# Altium schematic sheet Nuio_Left_Keyboard_Rev_H_Power.SchDoc: Nuio - Left Keyboard Power
size B; Organization: OLogic, Inc.; SheetNumber: 3; SheetTotal: 5; PageSetup: Record=PageOptions|CenterHorizontal=True|CenterVertical=True|PrintScale=0.95|XCorrection=1.00|YCorrection=1.00|PrintKind=1|BorderSize=5000000|LeftOffset=0|BottomOffset=0|Orientation=2|PaperLength=1000|PaperWidth=1000|Scale=100|PaperSource=7|PrintQuality=-4|MediaType=1|DitherType=10|PaperKind=Letter|PrintScaleMode=1
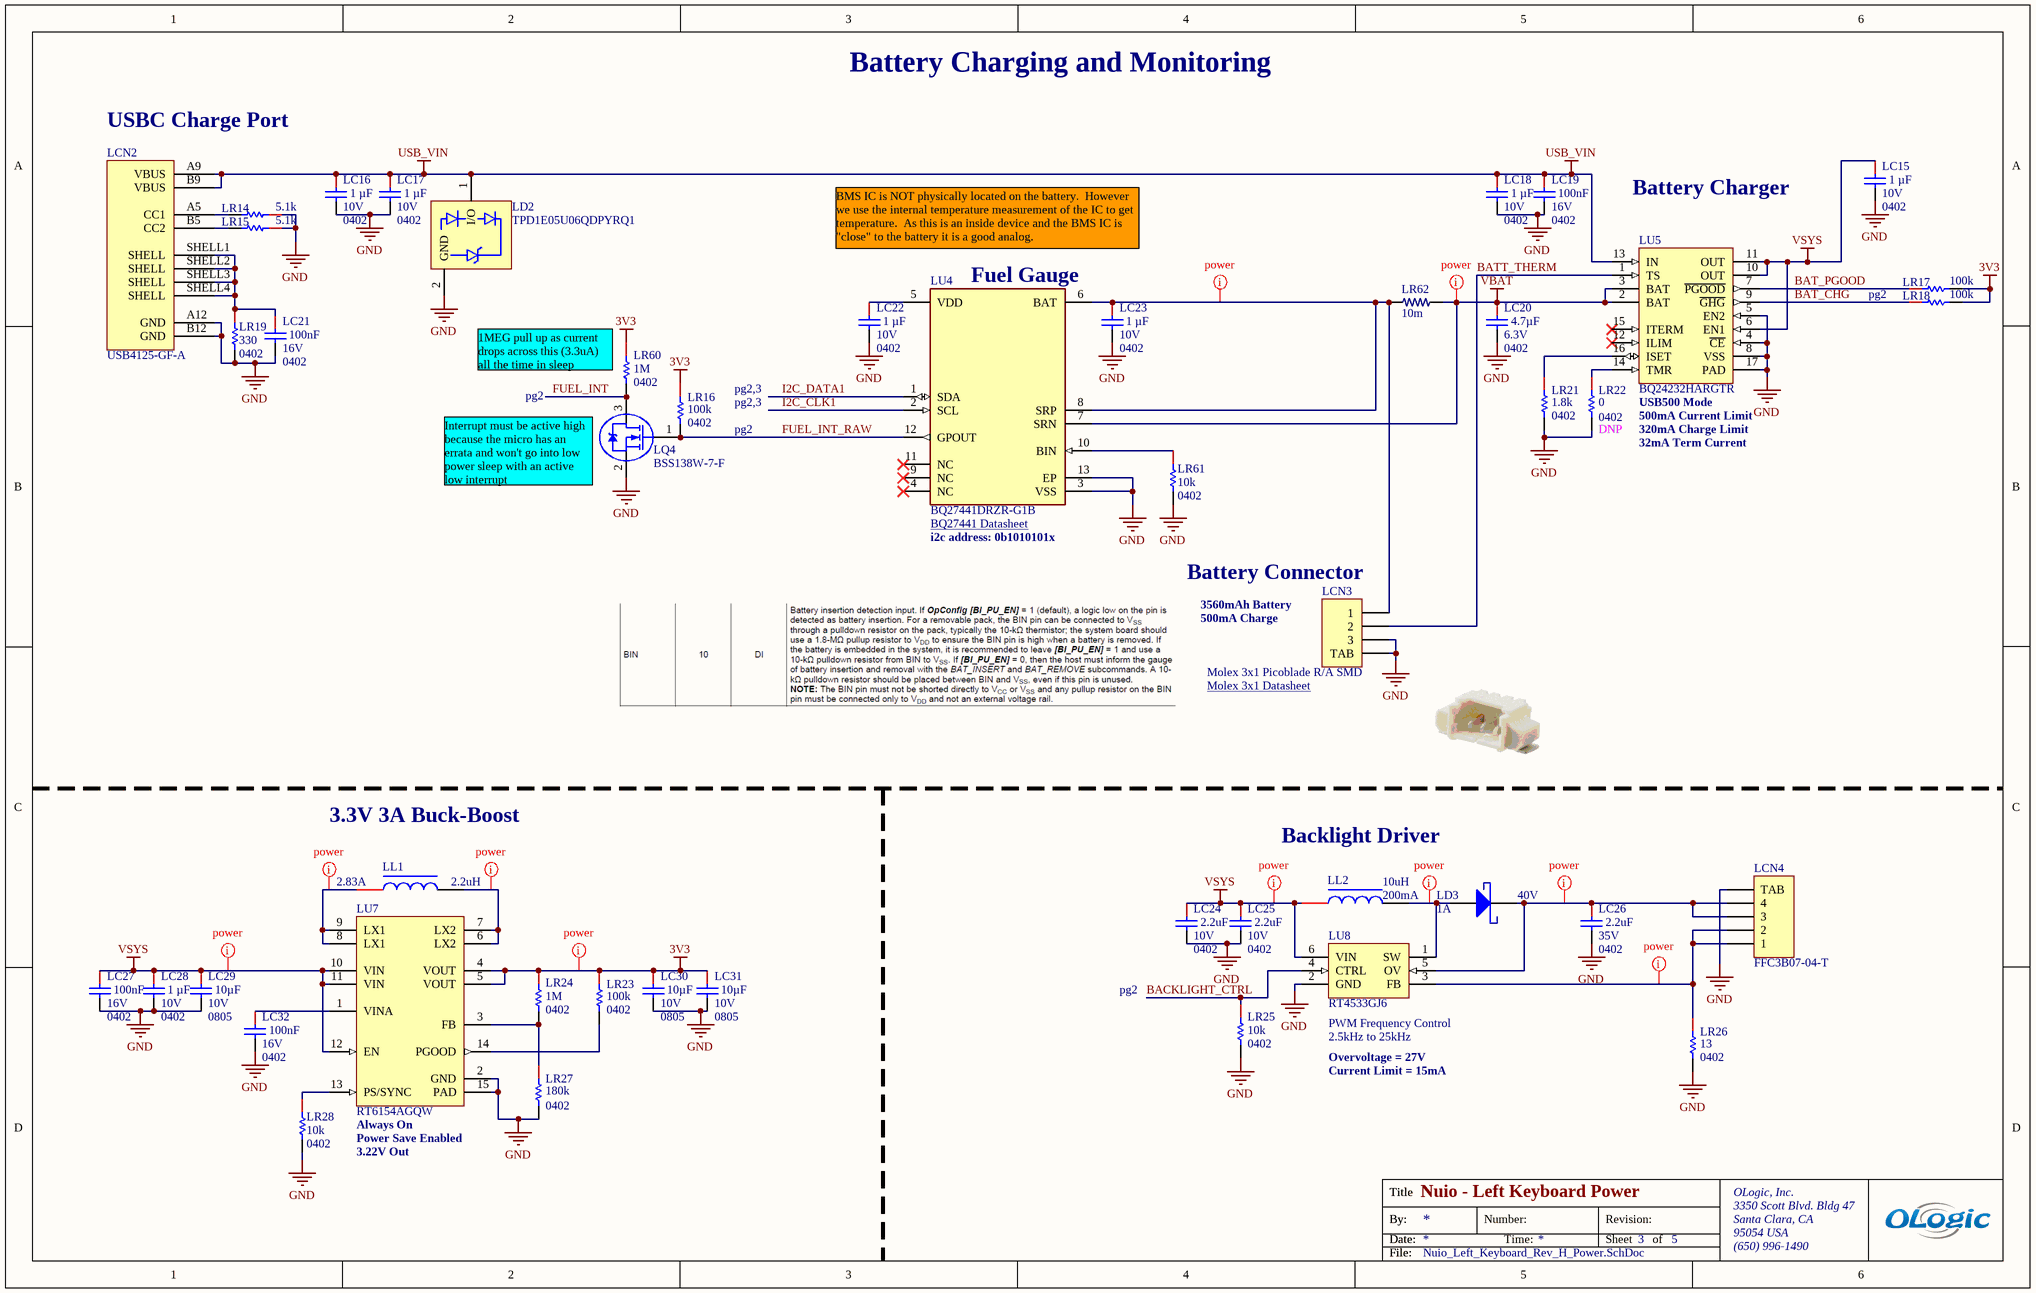
[diagram p0: Nuio_Left_Keyboard_Rev_H_Power.SchDoc]

## Parts
LC15  Package (Imperial): 0402  Voltage (Rated): 10V  Capacitance: 1 µF  [CAPC0402(1005)_L]  (hidden comment: CAP CER 1UF 10V X5R 0402)
LC16  Package (Imperial): 0402  Voltage (Rated): 10V  Capacitance: 1 µF  [CAPC0402(1005)_L]  (hidden comment: CAP CER 1UF 10V X5R 0402)
LC17  Package (Imperial): 0402  Voltage (Rated): 10V  Capacitance: 1 µF  [CAPC0402(1005)_L]  (hidden comment: CAP CER 1UF 10V X5R 0402)
LC18  Package (Imperial): 0402  Voltage (Rated): 10V  Capacitance: 1 µF  [CAPC0402(1005)_L]  (hidden comment: CAP CER 1UF 10V X5R 0402)
LC19  Package (Imperial): 0402  Voltage (Rated): 16V  Capacitance: 100nF  [CAPC0402(1005)_L]  (hidden comment: CAP CER 0.1UF 16V X5R 0402)
LC20  Package (Imperial): 0402  Voltage (Rated): 6.3V  Capacitance: 4.7µF  [CAPC0402(1005)_L]  (hidden comment: 4.7uF)
LC21  Package (Imperial): 0402  Voltage (Rated): 16V  Capacitance: 100nF  [CAPC0402(1005)_L]  (hidden comment: CAP CER 0.1UF 16V X5R 0402)
LC22  Package (Imperial): 0402  Voltage (Rated): 10V  Capacitance: 1 µF  [CAPC0402(1005)_L]  (hidden comment: CAP CER 1UF 10V X5R 0402)
LC23  Package (Imperial): 0402  Voltage (Rated): 10V  Capacitance: 1 µF  [CAPC0402(1005)_L]  (hidden comment: CAP CER 1UF 10V X5R 0402)
LC24  Package (Imperial): 0402  Voltage (Rated): 10V  Capacitance: 2.2uF  [CAPC0402(1005)_L]  (hidden comment: CAP CER 2.2UF 10V X5R 0402)
LC25  Package (Imperial): 0402  Voltage (Rated): 10V  Capacitance: 2.2uF  [CAPC0402(1005)_L]  (hidden comment: CAP CER 2.2UF 10V X5R 0402)
LC26  2.2uF  Voltage (Rated): 35V  Package (Imperial): 0402  [CAPC0402(1005)_L]
LC27  Package (Imperial): 0402  Voltage (Rated): 16V  Capacitance: 100nF  [CAPC0402(1005)_L]  (hidden comment: CAP CER 0.1UF 16V X5R 0402)
LC28  Package (Imperial): 0402  Voltage (Rated): 10V  Capacitance: 1 µF  [CAPC0402(1005)_L]  (hidden comment: CAP CER 1UF 10V X5R 0402)
LC29  Voltage (Rated): 10V  Package (Imperial): 0805  Capacitance: 10µF  [CAPC0805(2012)_L]  (hidden comment: CAP CER 10UF 10V X7R 0805)
LC30  Voltage (Rated): 10V  Package (Imperial): 0805  Capacitance: 10µF  [CAPC0805(2012)_L]  (hidden comment: CAP CER 10UF 10V X7R 0805)
LC31  Voltage (Rated): 10V  Package (Imperial): 0805  Capacitance: 10µF  [CAPC0805(2012)_L]  (hidden comment: CAP CER 10UF 10V X7R 0805)
LC32  Package (Imperial): 0402  Voltage (Rated): 16V  Capacitance: 100nF  [CAPC0402(1005)_L]  (hidden comment: CAP CER 0.1UF 16V X5R 0402)
LCN2  USB4125-GF-A  [USB4125-GF-A]
LCN3  Molex 3x1 Picoblade R/A SMD  [Molex 3x1 Picoblade R_A SMD]
LCN4  FFC3B07-04-T  [FFC3B07-04-T]
LD2  TPD1E05U06QDPYRQ1  [FP-DPY0002A-MFG]
LD3  DC Reverse Voltage Max: 40V  Current Avg Rectified: 1A  [PMEG4010AESBYL-Footprint-1]  (hidden comment: PMEG4010AESBYL)
LL1  Inductance: 2.2uH  Current Rating (Amps): 2.83A  [FIXED IND 2.2UH 2.83A 74MOHM SMD]  (hidden comment: FIXED IND 2.2UH 2.83A 74MOHM SMD)
LL2  value 10uH  Saturation Current: 200mA  [FIXED IND 10UH 300MA 680MOHM SMD]  (hidden comment: FIXED IND 10UH 300MA 680MOHM SMD)
LQ4  BSS138W-7-F  [DIOD-SOT323-3_V]
LR14  Resistance: 5.1k  [RESC0402(1005)_L]  (hidden comment: RES SMD 5.1K OHM 1% 1/10W 0402)
LR15  Resistance: 5.1k  [RESC0402(1005)_L]  (hidden comment: RES SMD 5.1K OHM 1% 1/10W 0402)
LR16  value 100k  Case Code (Imperial): 0402  [RESC0402(1005)_L]  (hidden comment: RES 100K OHM 1% 1/16W 0402)
LR17  value 100k  [RESC0402(1005)_L]  (hidden comment: RES 100K OHM 1% 1/16W 0402)
LR18  value 100k  [RESC0402(1005)_L]  (hidden comment: RES 100K OHM 1% 1/16W 0402)
LR19  Resistance: 330  Package (Imperial): 0402  [RESC0402(1005)_L]  (hidden comment: RES SMD 330 OHM 1% 1/16W 0402)
LR21  value 1.8k  Case Code (Imperial): 0402  [RESC0402(1005)_L]  (hidden comment: RES SMD 1.8K OHM 0.1% 1/16W 0402)
LR22  Package (Imperial): 0402  Resistance: 0  [RESC0402(1005)_L]  (hidden comment: RES 0 OHM JUMPER 1/16W 0402)  (no BOM)
LR23  value 100k  Case Code (Imperial): 0402  [RESC0402(1005)_L]  (hidden comment: RES 100K OHM 1% 1/16W 0402)
LR24  Resistance: 1M  Case/Package: 0402  [RESC0402(1005)_L]  (hidden comment: RES 1M OHM 1% 1/16W 0402)
LR25  Resistance: 10k  Package (Imperial): 0402  [RESC0402_YAGEO]  (hidden comment: RES SMD 10K OHM 1% 1/16W 0402)
LR26  13  Case/Package: 0402  [RESC0402(1005)_L]
LR27  Package (Imperial): 0402  [RESC0402(1005)_L]  (hidden comment: 180k)
LR28  Resistance: 10k  Package (Imperial): 0402  [RESC0402_YAGEO]  (hidden comment: RES SMD 10K OHM 1% 1/16W 0402)
LR60  Resistance: 1M  Case/Package: 0402  [RESC0402(1005)_L]  (hidden comment: RES 1M OHM 1% 1/16W 0402)
LR61  Resistance: 10k  Package (Imperial): 0402  [RESC0402_YAGEO]  (hidden comment: RES SMD 10K OHM 1% 1/16W 0402)
LR62  10m  [0805 PACKAGE]
LU4  BQ27441DRZR-G1B  [FP-DRZ0012A-MFG]
LU5  BQ24232HARGTR  [BQ24232HARGTR]
LU7  RT6154AGQW  [PSON50P300X80_HS-15N]
LU8  RT4533GJ6  [RT4533GJ6]

## Nets
3V3: LC30.1 LC31.1 LR16.1 LR17.2 LR18.2 LR23.1 LR24.1 LR60.1 LU7.4(VOUT) LU7.5(VOUT)
GND: LC15.2 LC16.2 LC17.2 LC18.2 LC19.2 LC20.2 LC21.2 LC22.2 LC23.2 LC24.2 LC25.2 LC26.2 LC27.2 LC28.2 LC29.2 LC30.2 LC31.2 LC32.2 LCN2.A12(GND) LCN2.B12(GND) LCN3.0(TAB) LCN3.3 LCN4.0(TAB) LD2.2(GND) LQ4.2(S) LR14.1 LR15.1 LR19.2 LR21.2 LR22.2 LR25.2 LR26.2 LR27.2 LR28.2 LR61.2 LU4.3(VSS) LU4.13(EP) LU5.4(~{CE}) LU5.5(EN2) LU5.8(VSS) LU5.17(PAD) LU7.2(GND) LU7.15(PAD) LU8.2(GND)
USB_VIN: LC16.1 LC17.1 LC18.1 LC19.1 LCN2.A9(VBUS) LCN2.B9(VBUS) LD2.1(I/O) LU5.13(IN)
VBAT: LC20.1 LR62.2 LU4.7(SRN) LU5.2(BAT) LU5.3(BAT)
VSYS: LC15.1 LC24.1 LC25.1 LC27.1 LC28.1 LC29.1 LL2.1 LU5.6(EN1) LU5.10(OUT) LU5.11(OUT) LU7.10(VIN) LU7.11(VIN) LU7.12(EN) LU8.6(VIN)
BACKLIGHT_CTRL: LR25.1 LU8.4(CTRL)
BAT_CHG: LR18.1 LU5.9(~{GHG})
BAT_PGOOD: LR17.1 LU5.7(~{PGOOD})
BATT_THERM: LCN3.2 LU5.1(TS)
FUEL_INT: LQ4.3(D) LR60.2
FUEL_INT_RAW: LQ4.1(G) LR16.2 LU4.12(GPOUT)
I2C_CLK1: LU4.2(SCL)
I2C_DATA1: LU4.1(SDA)
NetLC21_1: LC21.1 LCN2.SHELL1(SHELL) LCN2.SHELL2(SHELL) LCN2.SHELL3(SHELL) LCN2.SHELL4(SHELL) LR19.1
NetLC22_1: LC22.1 LU4.5(VDD)
NetLC23_1: LC23.1 LCN3.1 LR62.1 LU4.6(BAT) LU4.8(SRP)
NetLC26_1: LC26.1 LCN4.3 LCN4.4 LD3.1(K) LU8.5(OV)
NetLC32_1: LC32.1 LU7.1(VINA)
NetLCN2_A5: LCN2.A5(CC1) LR14.2
NetLCN2_B5: LCN2.B5(CC2) LR15.2
NetLCN4_1: LCN4.1 LCN4.2 LR26.1 LU8.3(FB)
NetLD3_2: LD3.2(A) LL2.2 LU8.1(SW)
NetLL1_1: LL1.1 LU7.8(LX1) LU7.9(LX1)
NetLL1_2: LL1.2 LU7.6(LX2) LU7.7(LX2)
NetLR21_1: LR21.1 LU5.16(ISET)
NetLR22_1: LR22.1 LU5.14(TMR)
NetLR23_2: LR23.2 LU7.14(PGOOD)
NetLR24_2: LR24.2 LR27.1 LU7.3(FB)
NetLR28_1: LR28.1 LU7.13(PS/SYNC)
NetLR61_1: LR61.1 LU4.10(BIN)

Not connected (* = marked no-connect by the designer): LU4 4(NC)* 9(NC)* 11(NC)*; LU5 12(ILIM)* 15(ITERM)*

## Layout directives
net class power: 3V3, NetLC23_1, NetLC26_1, NetLCN4_1, NetLD3_2, NetLL1_1, NetLL1_2, VBAT, VSYS

## Notes on the sheet
- Battery Charging and Monitoring
- (near LCN2) USBC Charge Port
- Battery Charger
- BMS IC is NOT physically located on the battery.  However we use the internal temperature measurement of the IC to get temperature.  As this is an inside device and the BMS IC is "close" to the battery it is a good analog.
- (near LU4) Fuel Gauge
- pg2
- (near LR60) 1MEG pull up as current drops across this (3.3uA) all the time in sleep
- pg2,3
- (near LR22) DNP
- 500mA Current Limit
- 320mA Charge Limit
- (near LU5) USB500 Mode
- Interrupt must be active high because the micro has an errata and won't go into low power sleep with an active low interrupt
- 32mA Term Current
- (near LU4) i2c address: 0b1010101x
- (near LU4) BQ27441 Datasheet <https://www.ti.com/lit/gpn/bq27441-g1>
- (near LCN3) Battery Connector
- 3560mAh Battery
- 500mA Charge
- (near LCN3) Molex 3x1 Datasheet <https://www.molex.com/pdm_docs/sd/532610371_sd.pdf>
- 3.3V 3A Buck-Boost
- Backlight Driver
- (near LU8) PWM Frequency Control
- (near LU8) 2.5kHz to 25kHz
- Overvoltage = 27V
- Current Limit = 15mA
- Power Save Enabled
- (near LU7) Always On
- 3.22V Out
- Title
- By:
- Date:
- Number:
- Time:
- Revision:
- Sheet
- of
- OLogic, Inc.
- 3350 Scott Blvd. Bldg 47
- Santa Clara, CA
- 95054 USA
- File:
- (650) 996-1490

## Library data of the parts
LC15-LC18 LC22 LC23 LC28 = CMP-001-1453-04: ±20% 10V Ceramic Capacitor X5R 0402 (1005 Metric); Manufacturer Part Number: CC0402MRX5R6BB105; Manufacturer: Yageo; Supplier: Digi-Key; Tolerance: ±20%; Supplier Part Number: 311-1732-1-ND; Temperature Coefficient: X5R; Height: 0.55mm
LC19 LC21 LC27 LC32 = CMP-001-0605-23: ±10% 16V Ceramic Capacitor X5R 0402 (1005 Metric); Manufacturer: Taiyo Yuden; Manufacturer Part Number: EMK105BJ104KV-F; Package (Metric): 1005; Temperature (Max): 85°C; Temperature (Min): -55°C; Height: 550µm; Supplier: Digi-Key; Supplier Part Number: 587-1226-1-ND; Tolerance: 10%; Dielectric Material: Ceramic; Temperature Coefficient: X5R; Width: 500µm; Length: 1mm; Mounting Type: SMD
LC20 = CMP-007-0148-15: CAP CER 4.7UF 6.3V 10% X5R 0402; Tolerance: 20%; Package (Metric): 1005; Dielectric Material: Ceramic; Mounting Type: SMD; Temperature Coefficient: X5R
LC24 LC25 = CMP-001-1451-04: ±20% 10V Ceramic Capacitor X5R 0402 (1005 Metric); Manufacturer: KEMET; Manufacturer Part Number: C0402C225M8PACTU; Width: 0.5mm; Height: 0.5mm; Tolerance: 20%; Voltage Rating (DC): 10V; Supplier: Digi-Key; Depth: 0.5mm; Dielectric: X5R; Supplier Part Number: 399-7375-1-ND; Contact Plating: Tin,Matte; Termination: SMD/SMT; Thickness: 0.022inch; Dielectric Material: Ceramic; Temperature Coefficient: X5R; Length: 1mm; Max Operating Temperature: 85°C; Min Operating Temperature: -55°C; Mount: Surface Mount; Lead Free: Lead Free; Series: C
LC26 = CMP-007-0115-14: CAP CER 2.2UF 35V 10% X5R 0402; Capacitance: 2.2µF; Dielectric Material: Ceramic; Package (Metric): 1005; Tolerance: 10%; Temperature Coefficient: X5R; Mounting Type: SMD
LC29-LC31 = CMP-001-0889-04: 10µF ±10% 10V Ceramic Capacitor X7R 0805 (2012 Metric); Manufacturer Part Number: GRM21BR71A106KA73K; Package (Metric): 2012; Voltage Rating: 10V; Length: 2mm; Mounting Type: SMD; Height: 1.4mm; Mount: Surface Mount; Case Code (Metric): 2012; Min Operating Temperature: -55°C; Ratings: AEC-Q200; Width: 1.25mm; Packaging: Tape and Reel; Tolerance: 10%; Temperature Coefficient: X7R; Case Code (Imperial): 0805; Max Operating Temperature: 125°C; Case/Package: 0805; Dielectric Material: Ceramic
LCN2 = CMP-001-2121-03: USB-C (USB TYPE-C) Receptacle Connector 24 (6+18 Dummy) Position Surface Mount, Right Angle; Through Hole; Manufacturer: GCT; Mating Cycles: 20000; Current Rating: 3A; Shielding: Shielded; Material Flammability: UL94 V-0; Voltage: 20V; Connector Type: USB-C; Number of Contacts: 24 (6 + 18 Dummy); Gender: Receptacle; Series: USB4125; Contact Finish: Gold; Shell/Shielding Material: Steel, Stainless
LCN3 = CMP-00344-01: 1.25mm (.049") Pitch PicoBlade Header, Surface Mount, Right Angle, Lead-free, 3 Circuits; Manufacturer Series: 53261; Manufacturer Part Number 1: 53261-0371; Plating: Tin; Number of Positions: 3; Contact Resistance: 20mR; Option: General Purpose; Current Rating: 1A; Voltage Rating: 125V; Mixed Contacts: No; Number of Rows Loaded: 1; Insulation Resistance: 100MR; Gender: Male; Glow Wire Compliant: Non-compliant; Series: PicoBlade; Supplier 1: Digikey; RoHS: Yes; Category: Headers and Wire Housings; Stock 1: 7759; Pricing 1: 1=0.66, 10=0.558, 100=0.4344 (USD); Mounting Technology: Surface Mount,Board; Contact Plating: Tin; Contact Material: Bronze,Tin; Color: Natural; Housing Color: Natural; Housing Material: Nylon; Min Operating Temperature: -40°C; Max Operating Temperature: 85°C; Number of Rows: 1; Packaging: Tape and Reel; Termination: Solder; Orientation: Right Angle; Number of Contacts: 3; Contact Type: Blade Pin; Contact Gender: Male; Mounting Style: STRAIGHT; Filter Feature: No; Voltage Rating (AC): 125V; Working Voltage: 125V; Number of Circuits: 3; Voltage Rating (DC): 125V; Length: 8.9mm; Pitch: 1.25mm; Depth: 5.2mm; Radiation Hardening: No; RoHS Compliant: Yes; Flammability Rating: 5813Flammability; MIL Conformance: No; DIN Conformance: No; IEC Conformance: No; Reach SVHC Compliant: Unknown; Lead Free: Lead Free; Supplier Part Number 1: WM7621CT-ND; Manufacturer 1: Molex
LCN4 = CMP-001-2018-02: CONN, FPC, 4POS, 1ROW, 1MM, R/A SMT; Pitch Spacing: 1mm; No. of Contacts: 4Contacts; Gender: Receptacle; Product...; Manufacturer: GCT; Locking Feature: Slide Lock; Connector/Contact Type: Contacts, Bottom; Mating Cycles: 20; Number of Positions: 4; Voltage Rating: 50V; Current Rating: 0.4A; Contact Finish: Tin; Mounting Type: SM R/A; Pitch: 1mm
LD2 = CMP-009-0040-02: TVS DIODE 5.5V 14V 2X1SON; Manufacturer: Texas Instruments; Directionality: UNI-DIRECTIONAL!; Interface: LVDS,USB,Ethernet,HDMI; Max Power: 30W; Number of Channels: 1; RoHS Compliant: Yes; Manufacturer Part Number: TPD1E05U06QDPYRQ1; Lead Free: Lead Free; Height: 0.45mm; Max Operating Temperature: 125°C; Min Operating Temperature: -40°C
LD3 = CMP-001-0106-06: DIODE SCHOTTKY 40V 1A SOD993; Voltage Forward Max: 505mV @ 1A; Diode Type: Schottky
LL1 = CMP-001-1752-01: 2.2 µH Shielded Wirewound Inductor 2.83 A 74mOhm Max Nonstandard -; Manufacturer Product Number: VLS3012CX-2R2M-1; Manufacturer: TDK Corporation; Inductance Frequency - Test: 1MHz; Size / Dimension: 3mm x 3mm; DC Resistance (DCR): 74mOhm Max; Mounting Type: Surface Mount; RoHS Compliant: Yes
LL2 = CMP-001-2113-01: 10 µH Shielded Multilayer Inductor 300 mA 680mOhm 0805 (2012 Metric); Manufacturer Part Number: MLZ2012M100HT000; Test Frequency: 2MHz; Self Resonant Frequency: 40MHz; Tolerance: 20%; DC Resistance (DCR): 680mR; Core Material: Ferrite; Current Rating: 300mA; Max Operating Temperature: 125°C; Max DC Current: 300mA; Lead Free: Lead Free; Min Operating Temperature: -55°C; Length: 0.079inch; RoHS Compliant: Yes; Height - Seated (Max): 0.057inch; Width: 0.049inch; Shielding: Shielded; Series: MLZ; Case/Package: 0805; Height: 1.25mm
LQ4 = CMP-00300-01: DIODES INC. - BSS138W-7-F. - BSS FAMILY SOT323 T&R 3K ROHS COMPLIANT: YES; Manufacturer 1: Diodes Incorporated; Voltage: 50V; Power: 200mW; Current Rating: 200mA; Number of Channels: 1; Drain to Source Breakdown Voltage: 75V; Element Configuration: Single; Turn-On Delay Time: 20ns; Gate to Source Voltage (Vgs): 20V; Threshold Voltage: 1.2V; Input Capacitance: 50pF; On-State Resistance: 3.5R; Polarity: N-CHANNEL; Drain to Source Resistance: 1.4R; Drain to Source Voltage (Vdss): 50V; Number of Elements: 1; Lead Free: Lead Free; Min Operating Temperature: -55°C; Max Operating Temperature: 150°C; Nominal Vgs: 1.2V; Packaging: Tape and Reel; Drain-source On Resistance-Max: 3.5R; Width: 1.35mm; Termination: SMD/SMT; Rds On Max: 3.5R; Height: 1mm; REACH SVHC: No SVHC; Package Quantity: 3000; Case/Package: SOT-323; Contact Plating: Tin,Matte; RoHS Compliant: Yes; Length: 2.2mm; Number of Pins: 3; Mount: Surface Mount; Weight: 0.000212oz; Turn-Off Delay Time: 20ns; Series: -; Dual Supply Voltage: 50V; Max Power Dissipation: 200mW; Manufacturer Part Number 1: BSS138W-7-F; Continuous Drain Current (ID): 200mA; Supplier 1: Digi Key; Supplier Part Number 1: BSS138W-FDICT-ND
LR14 LR15 = CMP-007-0525-17: 5.1 kOhms ±1% 0.1W, 1/10W Chip Resistor 0402 (1005 Metric) Automotive AEC-Q200 Thick Film; Manufacturer: Panasonic Electronic Components; Manufacturer Part Number: ERJ-2RKF5101X; Package (Imperial): 0402; Max Power Dissipation: 100mW; Voltage Rating (DC): 50V; Power: 63mW; Temperature Coefficient: 100ppm/°C; Termination: SMD/SMT; Lead Free: Lead Free; Mount: Surface Mount; Length: 1mm; Width: 500µm; Min Operating Temperature: -55°C; Contact Plating: Tin; Weight: 2.8E-05oz; Voltage Rating: 50V; Height: 350µm; Depth: 0.5mm; Military Standard: Not; Composition: Thick Film; Power Rating: 100mW; Tolerance: 1%; Max Operating Temperature: 155°C; REACH SVHC: No SVHC
LR16-LR18 LR23 = CMP-007-0354-15: ±1% 0.063W, 1/16W Chip Resistor 0402 (1005 Metric) Moisture Resistant Thick Film; Manufacturer: YAGEO; Manufacturer Part Number: RC0402FR-07100KL; Max Power Dissipation: 63mW; Temperature Coefficient: 100ppm/°C; Voltage Rating: 50V; Case/Package: 0402; Construction: Rectangular; Depth: 0.5mm; Features: Moisture Resistant; Height: 0.016inch; Lead Free: Lead Free; Length: 0.039inch; Max Operating Temperature: 155°C; Military Standard: Not; Min Operating Temperature: -55°C; Power Rating: 63mW; Reach SVHC Compliant: No; Resistance Tolerance: 1%; Resistor Type: Thick Film; RoHS Compliant: Yes; Series: RC; Termination: SMD/SMT; Tolerance: 1%; Width: 0.02inch
  LR17 LR18: Case Code (Imperial): 0402
LR19 = CMP-007-0476-14: 330 Ohms ±1% 0.063W, 1/16W Chip Resistor 0402 (1005 Metric) Automotive AEC-Q200 Thick Film; Manufacturer Part Number: RC0402FR-07330RL; Power: 63mW; Temperature Coefficient: ±100ppm/°C; Package (Metric): 1005; Operating Temperature: -55°C ~ 155°C; Tolerance: 1%; Termination: SMD/SMT; Height: 400µm; Length: 1mm
LR21 = CMP-00034-19: 1.8 kOhms ±0.1% 0.063W, 1/16W Chip Resistor 0402 (1005 Metric) Automotive AEC-Q200 Thin Film; Manufacturer: Panasonic Electronic Components; Manufacturer Part Number: ERA-2AEB182X; Temperature Coefficient: 25ppm/°C; Max Power Dissipation: 63mW; Voltage Rating: 50V; Voltage Rating (DC): 25V; Min Operating Temperature: -55°C; Max Operating Temperature: 155°C; Length: 0.039inch; Tolerance: 0.1%; Width: 0.02inch; Height: 0.016inch; Termination: SMD/SMT; Case/Package: 0402; Construction: Rectangular; Contact Plating: Tin; Depth: 0.5mm; Lead Free: Lead Free; Mounting Technology: Surface Mount; Power Rating: 63mW; Reach SVHC Compliant: Unknown; Resistance Tolerance: 0.1%; Resistor Type: Thin Film; RoHS Compliant: Yes; Series: ERA-2A
LR22 = CMP-007-0298-18: 0 Ohms Jumper Chip Resistor 0402 (1005 Metric) Automotive AEC-Q200 Thick Film; Manufacturer: Stackpole Electronics Inc; Manufacturer Part Number: RMCF0402ZT0R00; Package (Metric): 1005; Power: 63mW; Tolerance: 0%; Termination: SMD/SMT; Operating Temperature: -55°C ~ 155°C; Height: 400µm; Length: 1mm
LR24 LR60 = CMP-001-1995-03: 1 MOhms ±1% 0.063W, 1/16W Chip Resistor 0402 (1005 Metric) Moisture Resistant Thick Film; Manufacturer: YAGEO; Manufacturer Part Number: RC0402FR-071ML; Power Rating: 63mW; Voltage Rating: 50V; Temperature Coefficient: 100ppm/°C; Termination: SMD/SMT; Technology: THICK FILM; Features: Moisture Resistant; Depth: 0.5mm; RoHS Compliant: Yes; Military Standard: Not; Series: RC; Construction: Rectangular; Resistance Tolerance: 1%; Size Code: 0402; Length: 1mm; Resistor Type: Thick Film; Min Operating Temperature: -55°C; Max Power Dissipation: 63mW; Height: 0.32mm; Lead Free: Lead Free; Max Operating Temperature: 155°C; Tolerance: 1%; REACH SVHC: Unknown
LR25 LR28 LR61 = CMP-001-1262-04: 10 kOhms ±1% 0.063W, 1/16W Chip Resistor 0402 (1005 Metric) Anti-Sulfur, Automotive AEC-Q200, Moisture Resistant Thin Film; Manufacturer: Yageo; Manufacturer Part Number: AT0402FRE0710KL; Max Power Dissipation: 63mW; Temperature Coefficient: 50ppm/°C; Width: 0.02inch; Case Code (Metric): 1005; Height: 0.014inch; Min Operating Temperature: -55°C; Supplier: Digi-Key; Tolerance: 1%; Features: Moisture Resistant,Automotive AEC-Q200,Anti-Sulfur; Length: 0.039inch; Number of Terminations: 2; Case/Package: 0402; Packaging: Tape and Reel; Composition: Thin Film; Supplier Part Number: YAG2104CT-ND; Max Operating Temperature: 155°C
LR26 = CMP-001-2304-01: SMD Chip Resistor, 13 Ohm, ± 1%, 63 mW, 0402 [1005 Metric], Thick Film, General Purpose; Manufacturer 1: Yageo; Manufacturer Part Number 1: RC0402FR-0713RL; Temperature Coefficient: 100ppm/°C; Max Power Dissipation: 63mW; Power Rating: 62.5mW; Value: 13R; Voltage Rating: 50V; Max Operating Temperature: 155°C; Height: 0.016inch; Width: 0.5mm; Min Operating Temperature: -55°C; Length: 1mm; Termination: SMD/SMT; Tolerance: 1%; Case Code (Metric): 1005; Supplier 1: Digikey; RoHS: Yes; Category: Chip SMD Resistors; Stock 1: 239263; Pricing 1: 1=0.1, 10=0.015, 50=0.0088, 100=0.0073, 500=0.00488, 1000=0.00417, 5000=0.00297 (USD); Case Code (Imperial): 0402; Contact Plating: Tin,Matte; Packaging: Tape and Reel; Number of Terminations: 2; Voltage Rating (DC): 50V; Features: Moisture Resistant; Series: RC; Construction: Rectangular; Depth: 0.5mm; Military Standard: Not; Lead Free: Lead Free; RoHS Compliant: Yes; ComponentLink1URL: https://datasheet.ciiva.com/17423/pyu-rc0402-51-rohs-l-6-r-17423990.pdf?src-supplier=Future+Electronics; ComponentLink1Description: https://datasheet.ciiva.com/17423/pyu-rc0402-51-rohs-l-6-r-17423990.pdf?src-supplier=Future+Electronics; ComponentLink2URL: https://datasheet.ciiva.com/15189/getdatasheetpartid-327833-15189354.pdf?src-supplier=Verical; ComponentLink2Description: https://datasheet.ciiva.com/15189/getdatasheetpartid-327833-15189354.pdf?src-supplier=Verical; Supplier Part Number 1: YAG2977CT-ND
LR27 = CMP-001-2044-03: RES 180K OHM 1% 1/16W 0402; Power: 63mW; Temperature Coefficient: 100ppm/°C; Package (Metric): 1005; Min Operating Temperature: -55°C; Max Operating Temperature: 155°C; Width: 500µm; Termination: SMD/SMT; Tolerance: 1%; Resistance: 180k; Height: 400µm; Length: 1mm; Operating Temperature: -55°C ~ 155°C
LR62 = 10m 0805 Resistor 1%_1: 10mOhm 0805 Resistor 1%; Manufacturer 1: Yageo; Manufacturer Part Number 1: PE0805FRE470R01Z; Supplier 1: Digikey; RoHS: No; Category: Resistors; Stock 1: 23704; Pricing 1: 1=0.41, 10=0.281, 25=0.2188, 50=0.1614, 100=0.1122, 250=0.0978, 500=0.08066, 1000=0.05834 (USD); Supplier Part Number 1: 13-PE0805FRE470R01ZCT-ND
LU4 = CMP-04911-000067-1: IC BATT FUEL GAUGE LI-ION 12SON; Manufacturer 1: Texas Instruments; Operating Supply Voltage: 4.5V; Output Current: 500uA; Interface: I2C; Output Voltage: 600mV; Capacity: 8000mAh; Number of Cells: 1; Min Supply Voltage: -300mV; Max Supply Voltage: 6V; Package Quantity: 3000; Packaging: Tape and Reel; Mount: Surface Mount; Min Operating Temperature: -40°C; Max Operating Temperature: 85°C; Contact Plating: Gold; Number of Pins: 12; Lead Free: Lead Free; Manufacturer Part Number 1: BQ27441DRZR-G1B; Supplier 1: Digi Key; Supplier Part Number 1: 296-39942-1-ND
LU5 = CMP-001-1983-03: USB Friendly 0.5A Li-ion charger with power-Path, 10.5V OVP 16-VQFN -5 to 125; Manufacturer 1: Texas Instruments; Battery Chemistry: LITHIUM-ION; Battery Pack Voltage: 4.2V; Max Supply Voltage: 10.2V; Fault Protection: Over Voltage,Over Temperature,Short Circuit,Reverse Current; Number of Cells: 1; Max Charge Current: 500mA; Series: -; RoHS Compliant: Yes; Packaging: Cut Tape; Min Operating Temperature: -5°C; Interface: USB; Lead Free: Lead Free; Max Operating Temperature: 125°C; Case/Package: QFN; Supplier 1: Digikey; Manufacturer Part Number 1: BQ24232HARGTR; RoHS: Yes; Category: Battery Management; Stock 1: 10178; Pricing 1: 1=2.63, 10=2.361, 25=2.2272, 100=1.8974, 250=1.78164, 500=1.55894, 1000=1.29169 (USD); Mounting Technology: Surface Mount; ComponentLink1URL: http://www.ti.com/lit/ds/symlink/bq24232ha.pdf?src-supplier=Digikey; ComponentLink1Description: http://www.ti.com/lit/ds/symlink/bq24232ha.pdf?src-supplier=Digikey; ComponentLink2URL: http://www.ti.com/general/docs/suppproductinfo.tsp?distId=10&amp;gotoUrl=http%3A%2F%2Fwww.ti.com%2Flit%2Fgpn%2Fbq24232ha&src-supplier=Digikey; ComponentLink2Description: http://www.ti.com/general/docs/suppproductinfo.tsp?distId=10&amp;gotoUrl=http%3A%2F%2Fwww.ti.com%2Flit%2Fgpn%2Fbq24232ha&src-supplier=Digikey; Supplier Part Number 1: 296-49554-1-ND
LU7 = CMP-00353-03: IC REG BCK BST ADJ 4A 14WDFN; Manufacturer: Richtek USA Inc.; Min Input Voltage: 1.8V; Switching Frequency: 2.4MHz; Topology: Buck-Boost; Number of Outputs: 1; Output Type: Adjustable; Output Configuration: Positive; Max Output Voltage: 5.5V; Synchronous Rectifier: Yes; Output Current: 4A; Mount: Surface Mount; Manufacturer Part Number: RT6154AGQW; RoHS Compliant: Yes; Number of Pins: 14; Max Operating Temperature: 85°C; Min Operating Temperature: -40°C; REACH SVHC: No SVHC; Max Input Voltage: 5.5V; ManufacturerPartNumbers: RT6154AGQW; Min Output Voltage: 1.8V
LU8 = CMP-001-2111-02: IC LED DRVR RGLTR PWM TSOT23-6; Number of Outputs: 1; Topology: Boost; Frequency: 1.1MHz; Output Voltage: 36.5V; Output Current per Channel: 1.2A; Max Supply Voltage: 5.5V; Dimming: PWM; Max Operating Temperature: 85°C; Packaging: Cut Tape; Min Operating Temperature: -40°C; Mounting Technology: Surface Mount; Case/Package: SOT-23-6